# Altium schematic sheet Relays.SchDoc
size A4; SheetNumber: 6; SheetTotal: 8
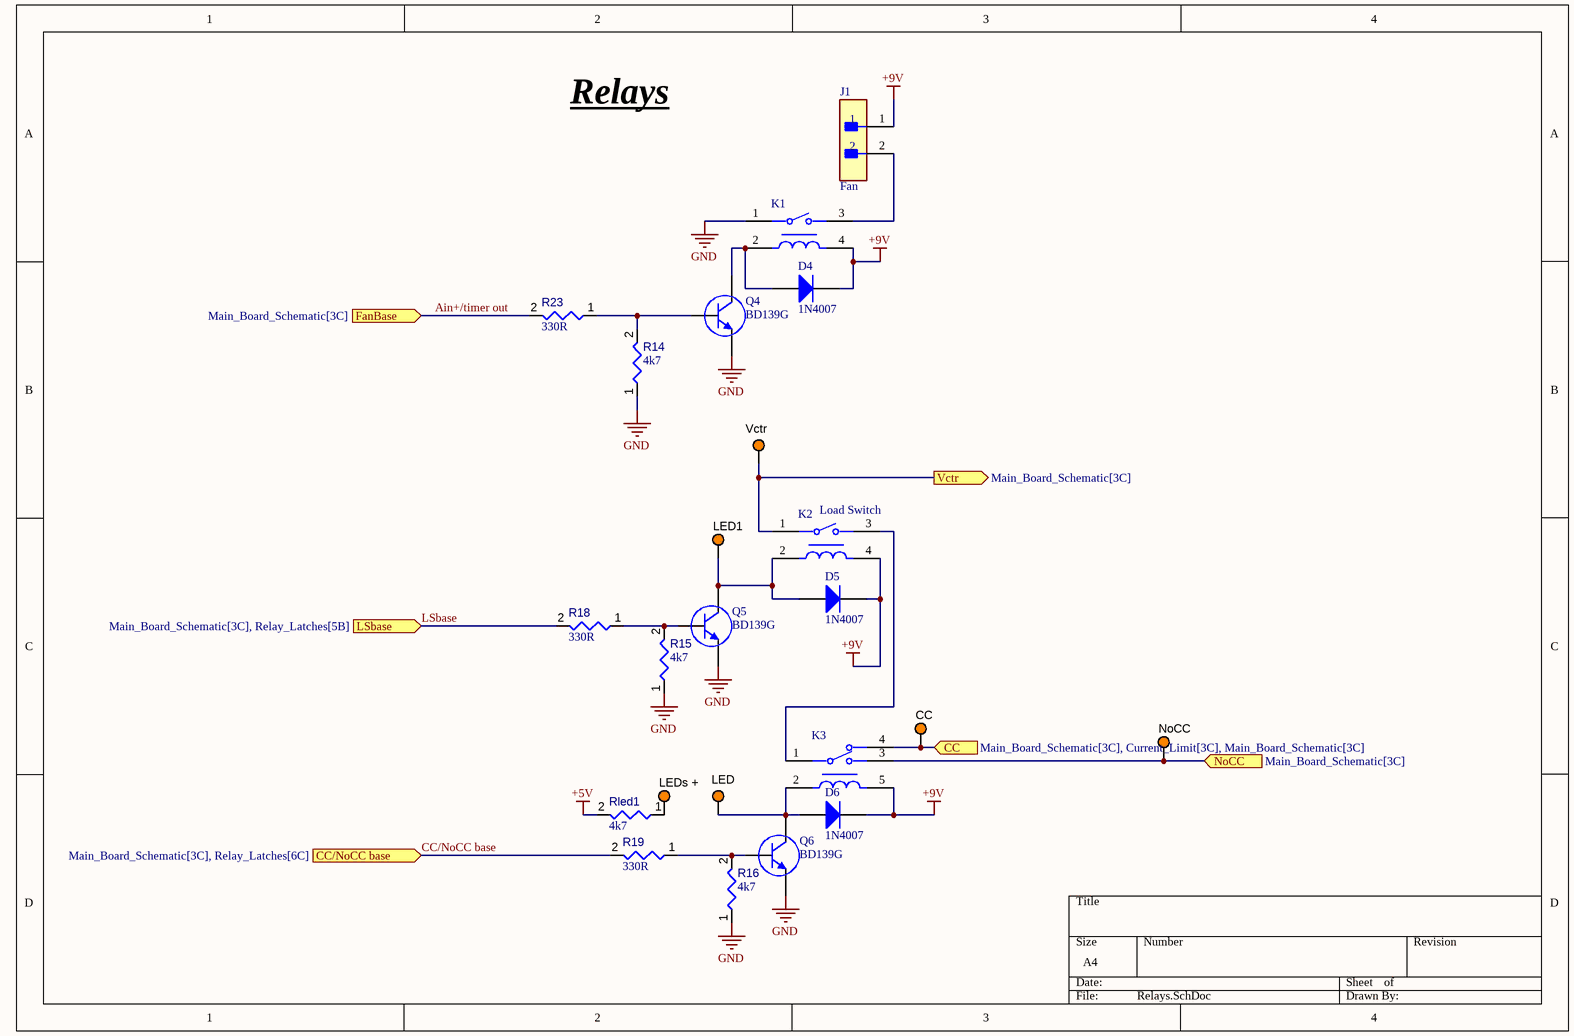
[diagram p0: Relays.SchDoc]

## Parts
CC  5003  [KSTN-5003]  (value not drawn)
D4  1N4007  [FAIR-DO-41-2]
D5  1N4007  [FAIR-DO-41-2]
D6  1N4007  [FAIR-DO-41-2]
J1  Fan  [FP-B2B-XH-A_LF_SN-MFG]
K1  LKQ1AF-5V-TV-5  [FP-LKQ1AF-5V-TV-5-MFG]  (value not drawn)
K2  Load Switch  [FP-LKQ1AF-5V-TV-5-MFG]
K3  G5LE-14-36 DC12  [FP-G5LE-14-36_DC12-MFG]  (value not drawn)
LED  5003  [KSTN-5003]  (value not drawn)
LED1  5003  [KSTN-5003]  (value not drawn)
LEDs_+  5003  [KSTN-5003]  (value not drawn)
NoCC  5003  [KSTN-5003]  (value not drawn)
Q4  BD139G  [FP-77-09-MFG]
Q5  BD139G  [FP-77-09-MFG]
Q6  BD139G  [FP-77-09-MFG]
R14  value 4k7  [RESA60-630X240]  (hidden comment: MFR-25FBF52-100R)
R15  value 4k7  [RESA60-630X240]  (hidden comment: MFR-25FBF52-100R)
R16  value 4k7  [RESA60-630X240]  (hidden comment: MFR-25FBF52-100R)
R18  value 330R  [RESA60-630X240]  (hidden comment: MFR-25FBF52-100R)
R19  value 330R  [RESA60-630X240]  (hidden comment: MFR-25FBF52-100R)
R23  value 330R  [RESA60-630X240]  (hidden comment: MFR-25FBF52-100R)
Rled1  value 4k7  [RESA60-630X240]  (hidden comment: MFR-25FBF52-100R)
Vctr  5003  [KSTN-5003]  (value not drawn)

## Ports
CC (in, see Main_Board_Schematic[3C], Current_Limit[3C], Main_Board_Schematic[3C]), CC/NoCC base (in, see Main_Board_Schematic[3C], Relay_Latches[6C]), FanBase (in, see Main_Board_Schematic[3C]), LSbase (in, see Main_Board_Schematic[3C], Relay_Latches[5B]), NoCC (in, see Main_Board_Schematic[3C]), Vctr (out, see Main_Board_Schematic[3C])

## Nets
+5V: Rled1.2
+9V: D4.1(K) D5.1(K) D6.1(K) J1.1 K1.4 K2.4 K3.5
GND: K1.1 Q4.1(E) Q5.1(E) Q6.1(E) R14.1 R15.1 R16.1
Ain+/timer out: R23.2 ; port FanBase
CC: CC.1 K3.4 ; port CC
CC/NoCC base: R19.2 ; port CC/NoCC base
LSbase: R18.2 ; port LSbase
NoCC: K3.3 NoCC.1 ; port NoCC
Vctr: K2.1 Vctr.1 ; port Vctr
NetD4_2: D4.2(A) K1.2 Q4.3(C)
NetD5_2: D5.2(A) K2.2 LED1.1 Q5.3(C)
NetD6_2: D6.2(A) K3.2 LED.1 Q6.3(C)
NetJ1_2: J1.2 K1.3
NetK2_3: K2.3 K3.1
NetLEDs_+_1: LEDs_+.1 Rled1.1
NetQ4_2: Q4.2(B) R14.2 R23.1
NetQ5_2: Q5.2(B) R15.2 R18.1
NetQ6_2: Q6.2(B) R16.2 R19.1

## Notes on the sheet
- Relays

## Library data of the parts
CC LED LED1 LEDs_+ NoCC Vctr = CMP-002-00037-2: Test Point, Orange, Height 4.6 mm, Tail Length 3 mm, 1-Pin THD, RoHS; Manufacturer: Keystone; Colour: Orange; Packaging: Bulk; Package Description: 1-Pin Through Hole Device, Dia 2.54 mm; Pins: 1; Package Reference: 5003; Datasheet Version: Jun-15; Case/Package: 5003; Mounting Technology: TH; Connector Type: TestPoint; Diameter: 2.54mm; Contact Material: Bronze; Datasheet URL: http://keyelco.com/userAssets/file/M65p56.pdf; Manufacturer URL: http://www.keyelco.com/; Package Quantity: 10; Contact Plating: Tin; RoHS Compliant: True
D4-D6 = CMP-004-00007-2: General Purpose Rectifier, 1.1 V, 1.0 A, -55 to 175 degC, 2-Pin DO-41, RoHS, Tape and Reel; Manufacturer: Fairchild; Peak Reverse Current: 5uA; Max Surge Current: 30A; Elements: 1; Forward Voltage: 1.1V; Package Version: Rev. 2, 09/2008; Forward Current: 1A; Package Quantity: 5000; Packaging: TapeandReel; Package URL: http://www.fairchildsemi.com/dwg/DO/DO41A.pdf; Manufacturer URL: https://www.fairchildsemi.com/; Package Reference: DO-41-2; Pins: 2; Min Operating Temperature: -55°C; Datasheet Version: Rev. 1.1.0, 11/2014; Max Operating Temperature: 175°C; RoHS Compliant: True; Case/Package: DO-41-2; Mounting Technology: TH; Package Description: 2-Pin Axial Lead, Dia 2.375 mm, Body Length 4.63 mm; Datasheet URL: https://www.fairchildsemi.com/datasheets/1N/1N4007.pdf
J1 = CMP-2000-05888-3: CONN HEADER VERT 2POS 2.5MM; Current Rating: 3A; Voltage Rating: 250V; Number of Contacts: 2; Contact Resistance: 20mR; Wire/Cable Gauge: 22AWG; Insulation Resistance: 1GR; Connector Type: Male Pin; Packaging: Bulk; Contact Material: Brass; Lead Free: Lead Free; Orientation: Straight; Contact Plating: Tin; Max Current Rating: 3A; Termination: Solder; Fastening Type: Detent; Depth: 5.75mm; Housing Material: Polyamide; REACH SVHC: No SVHC; Series: XH; Voltage Rating (AC): 250V; Number of Positions: 2; Color: Natural; Contact Type: Male Pin; Max Voltage Rating (DC): 250V; Pitch: 2.5mm; Lead Pitch: 2.5mm; Mount: Through Hole; Max Operating Temperature: 85°C; Length: 7.4mm; Max Voltage Rating (AC): 250V; Min Operating Temperature: -25°C; Number of Rows: 1; Housing Color: White
K1 K2 = CMP-008-00006-1: Quiet Type, High Sensitivity 250MW, Slim Power Relay
K3 = CMP-08822-000072-1: RELAY GEN PURPOSE SPDT 10A 12V; Coil Resistance: 400R; Release Time: 5ms; Max Voltage Rating (DC): 125V; Coil Current: 30mA; Coil Power: 360mW; Relay Type: General Purpose; Coil Type: Non-Latching; Max Voltage Rating (AC): 250V; Operate Time: 10ms; Package Quantity: 100; Number of Pins: 5; Mount: Through Hole; Termination: PC Pin; Series: G5LE; Min Operating Temperature: -25°C; Max Operating Temperature: 85°C; Throw Configuration: SPDT; Coil Voltage (DC): 12V; Radiation Hardening: No; Contact Current Rating: 10A; Packaging: Tray; Contact Material: Tin
Q4-Q6 = CMP-013-00034-1: 1.5 A, 80 V NPN Power Bipolar Junction Transistor. ONSSPCTRNSTLT1T0R;; Case/Package: TO-225; Max Operating Temperature: 150°C; Pins: 3; Min Operating Temperature: -55°C
R14-R16 R18 R19 R23 Rled1 = CMP-009-00046-4: Axial Resistor, 100 Ohm, +/- 1%, 0.25 W, -55 to 155 degC, 2-Pin THD, RoHS, Bulk; Manufacturer: Yageo; Voltage Rating: 250V; Power: 250mW; Packaging: Bulk; Max Operating Temperature: 155°C; Mounting Technology: TH; Datasheet Version: Apr-13; Case/Package: Axial; RoHS Compliant: True; Package Description: 2-Pin Axial Lead, Dia 2.4 mm, Body Length 6.3 mm; Package Quantity: 200; Package Reference: MFR-25; Tolerance: 1%; Composition: CarbonFilm; Datasheet URL: http://www.yageo.com/documents/recent/Yageo%20LR_MFR_2013.pdf; Manufacturer URL: http://www.yageo.com/; Min Operating Temperature: -55°C